# EAGLE schematic final2 (EAGLE 9.6.2)
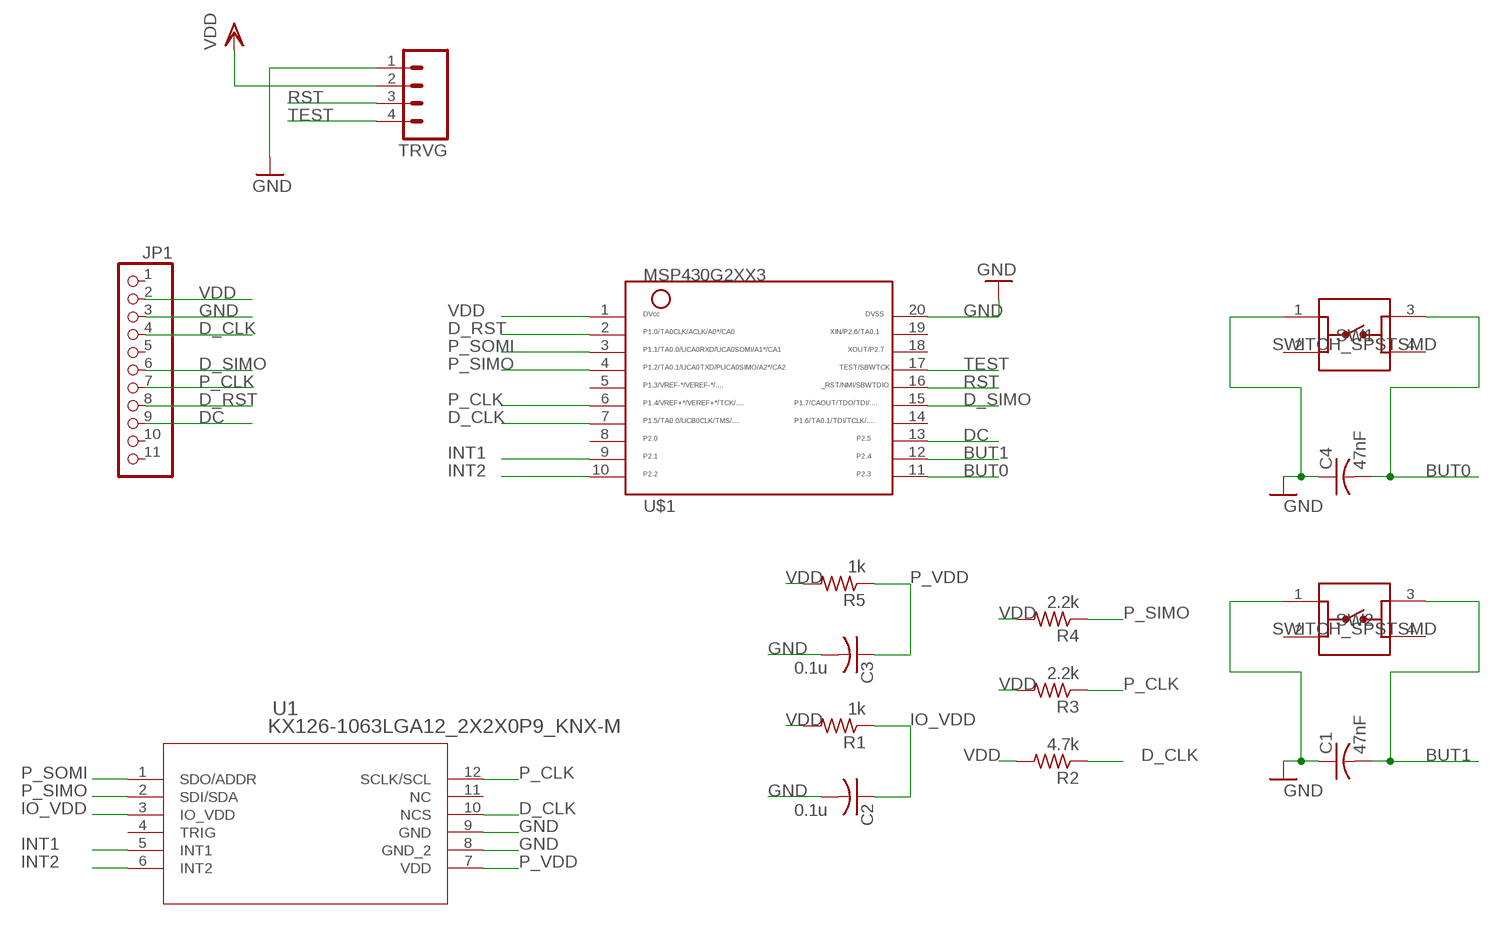
[diagram p0: schematic, sheet 1]

## Parts
C1  47nF  C-USC0603  [C0603]
C2  0.1u  C-USC0603  [C0603]
C3  0.1u  C-USC0603  [C0603]
C4  47nF  C-USC0603  [C0603]
JP1  HEADER-1X11  [1X11_ROUND]
R1  1k  R-US_R0402  [R0402]
R2  4.7k  R-US_R0402  [R0402]
R3  2.2k  R-US_R0402  [R0402]
R4  2.2k  R-US_R0402  [R0402]
R5  1k  R-US_R0402  [R0402]
SW1  SWITCH_SPSTSMD  [SW_1571563-4]
SW2  SWITCH_SPSTSMD  [SW_1571563-4]
TRVG  M04LOCK  [1X04_LOCK]
U1  KX126-1063LGA12_2X2X0P9_KNX-M  [LGA12_2X2X0P9_KNX-M]
U$1  MSP430G2XX3TSSOP  [PW20]

## Nets
BUT0: C4.2 SW1.3 U$1.11
BUT1: C1.2 SW2.3 U$1.12
D_CLK: JP1.4 R2.1 U1.10(NCS) U$1.7
D_RST: JP1.8 U$1.2
D_SIMO: JP1.6 U$1.15
DC: JP1.9 U$1.13
GND: C1.1 C2.2 C3.2 C4.1 JP1.3 SW1.1 SW2.1 TRVG.1 U1.8(GND_2) U1.9(GND) U$1.20
INT1: U1.5(INT1) U$1.9
INT2: U1.6(INT2) U$1.10
IO_VDD: C2.1 R1.1 U1.3(IO_VDD)
P_CLK: JP1.7 R3.1 U1.12(SCLK/SCL) U$1.6
P_SIMO: R4.1 U1.2(SDI/SDA) U$1.4
P_SOMI: U1.1(SDO/ADDR) U$1.3
P_VDD: C3.1 R5.1 U1.7(VDD)
RST: TRVG.3 U$1.16
TEST: TRVG.4 U$1.17
VDD: JP1.2 R1.2 R2.2 R3.2 R4.2 R5.2 TRVG.2 U$1.1
Unconnected: JP1.1 JP1.5 JP1.10 JP1.11 SW1.2 SW1.4 SW2.2 SW2.4 U1.4(TRIG) U1.11(NC) U$1.5 U$1.8 U$1.14 U$1.18 U$1.19

## Library data of the parts
C1-C4 = rcl:C-US: CAPACITOR, American symbol; SPICEPREFIX: C
JP1 = microbuilder:HEADER-1X11
R1-R5 = rcl:R-US_: RESISTOR, American symbol; SPICEPREFIX: R
SW1 SW2 = ELEC327:SWITCH_SPST: TE Connectivity Alcoswitch, 6mm Switch Tactile OFF (ON) SPST Round Button PC Pins 0.05A 24VDC 100000Cycles 2.55N Thru-Hole Loose Through Hole Version 1825910-7 <https://www.digikey.com/en/products/detail/te-connectivity-alcoswitch-switches/1825910-7/1731414> Surface Mount Version 1571563-4 <https://www.digikey.com/en/products/detail/te-connectivity-alcoswitch-switches/1571563-4/2400231>
TRVG = Pendant:M04: Header 4 Standard 4-pin 0.1" header. Use with straight break away headers (SKU : PRT-00116), right angle break away headers (PRT-00553), swiss pins (PRT-00743), machine pins (PRT-00117), and female headers (PRT-00115). Molex polarized connector foot print use with SKU : PRT-08231 with associated crimp pins and housings.
U1 = Juan_pedometer:KX126-1063; COPYRIGHT: Copyright (C) 2021 Ultra Librarian. All rights reserved.; DIGI-KEY_PART_NUMBER_1: 1191-1058-2-ND; DIGI-KEY_PART_NUMBER_2: 1191-1058-1-ND; DIGI-KEY_PART_NUMBER_3: 1191-1058-6-ND; MANUFACTURER_PART_NUMBER: KX126-1063; MFR_NAME: Kionix
U$1 = ELEC327:MSP430G2XX3: MSP430G2XX3 PDIP (N) 20 Pin Package